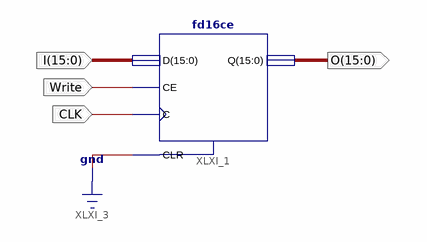
[diagram p0: schematic sheet 1]
// Xilinx ISE schematic reg64.sch (spartan3e) as structural Verilog: 1 symbols, 4 ports
module reg64 (
  input  [15:0] I,
  input  Write,
  input  CLK,
  output [15:0] O
);

  fd16ce XLXI_1 (.C(CLK), .CE(Write), .CLR(1'b0), .D(I), .Q(O));
endmodule
